# EAGLE schematic ewheel32 (EAGLE 7.7.0)
AUTHOR: (C) Peter Schmid <peter@spyr.ch>; COPYRIGHT: This work is licensed under a Creative Commons Attribution-ShareAlike 4.0 International Public License. http://creativecommons.org/licenses/by-sa/4.0/; LINK: http://veloblingbling.ch; PROJECT_NAME: Velo Bling-Bling; VERSION: Version: 2.3

## Sheet 1 of 2
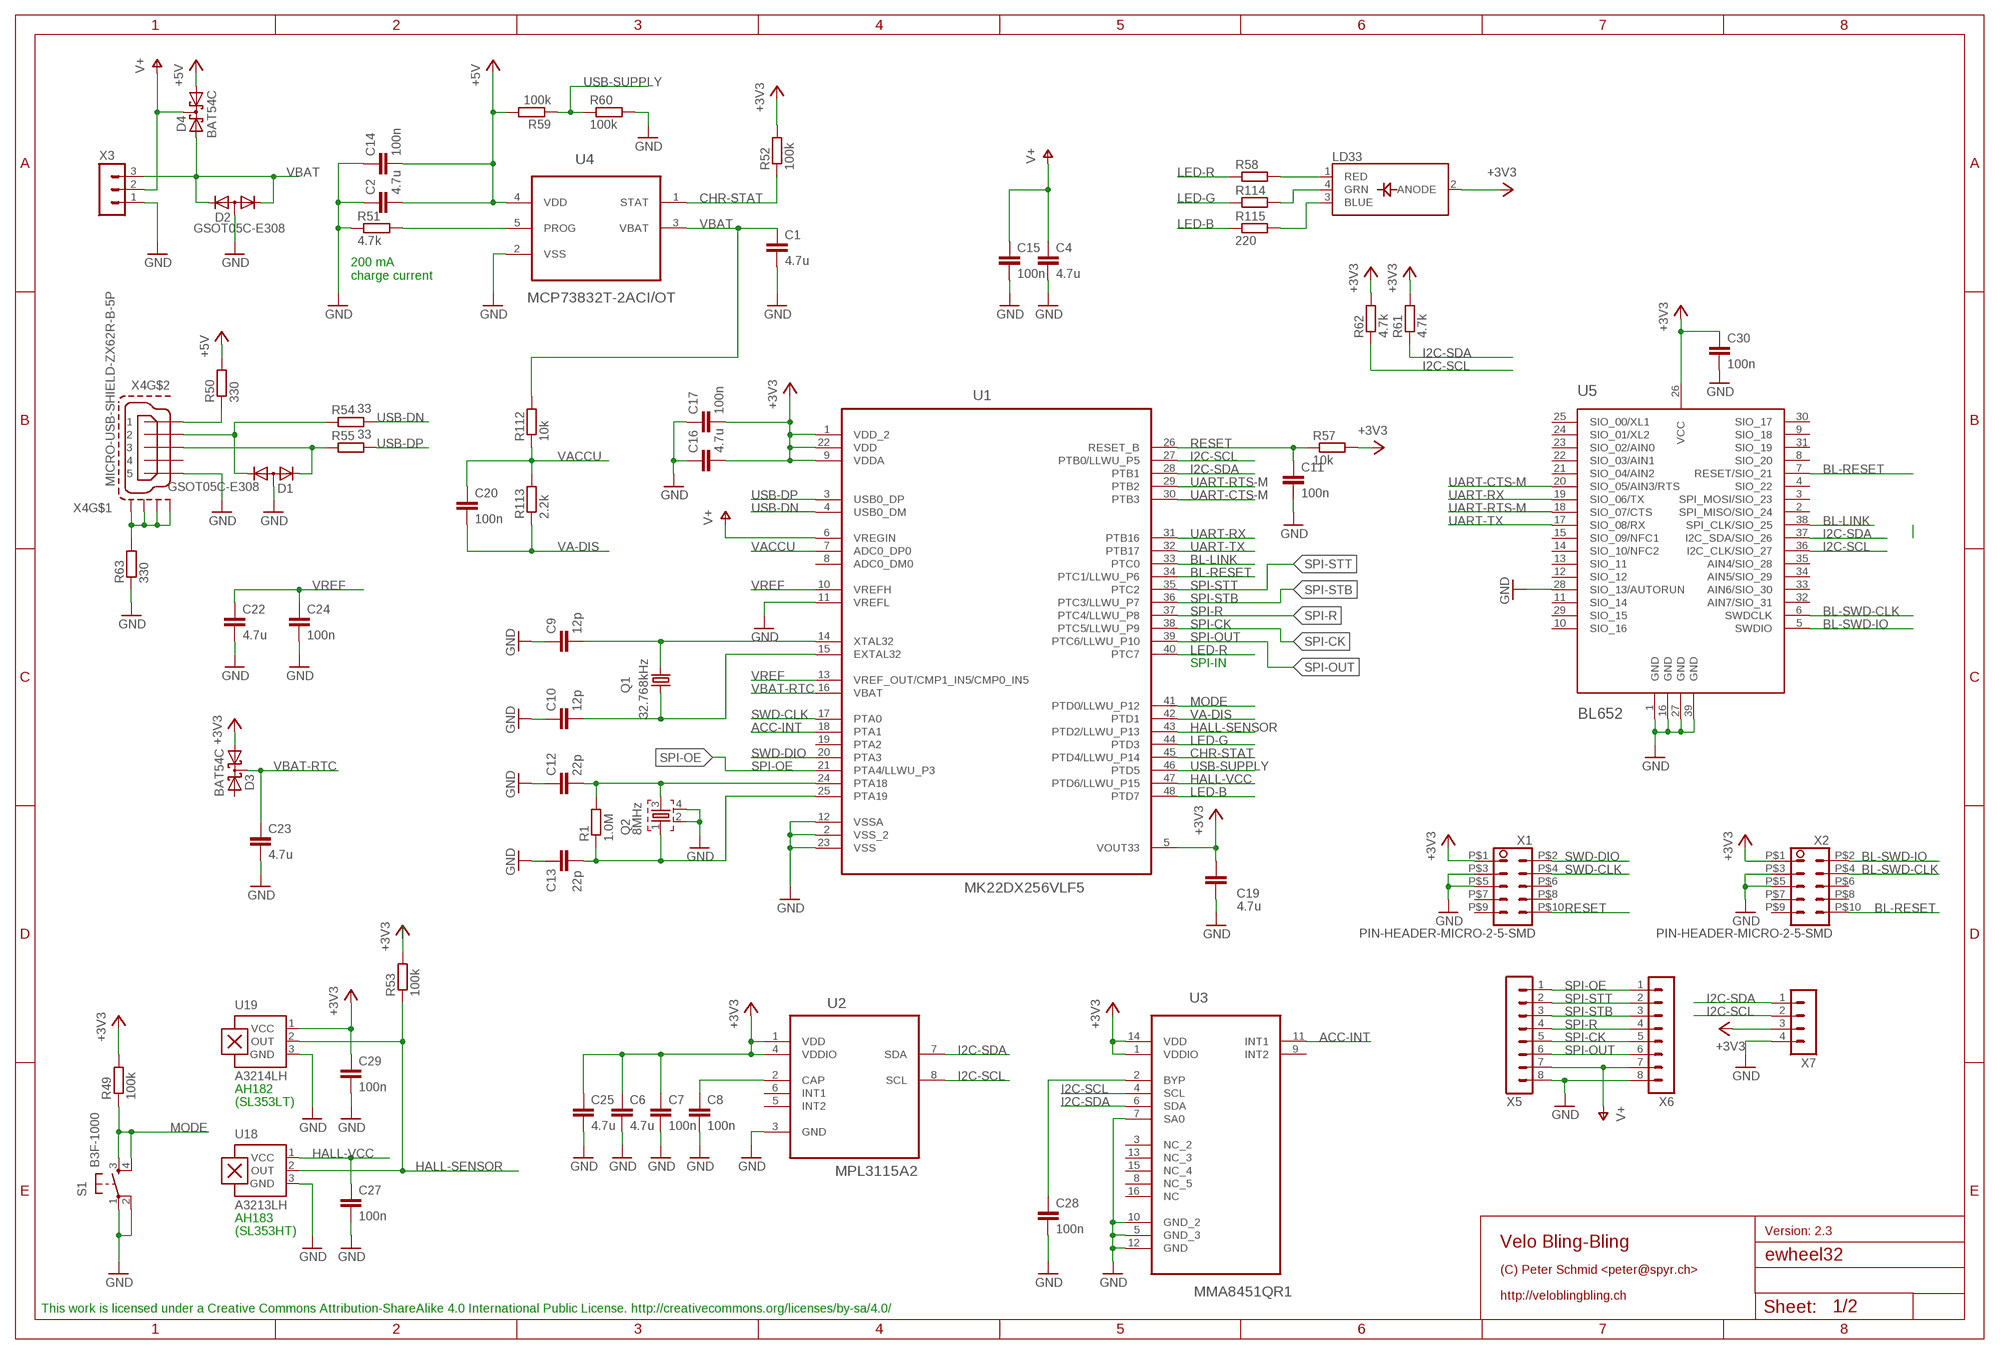
[diagram p0: schematic, sheet 1]

### Parts
C1  4.7u  C-EUC0805  [C0805]
C2  4.7u  C-EUC0805  [C0805]
C4  4.7u  C-EUC0805  [C0805]
C6  4.7u  C-EUC0805  [C0805]
C7  100n  C-EUC0805  [C0805]
C8  100n  C-EUC0805  [C0805]
C9  12p  C-EUC0805  [C0805]
C10  12p  C-EUC0805  [C0805]
C11  100n  C-EUC0805  [C0805]
C12  22p  C-EUC0805  [C0805]
C13  22p  C-EUC0805  [C0805]
C14  100n  C-EUC0805  [C0805]
C15  100n  C-EUC0805  [C0805]
C16  4.7u  C-EUC0805  [C0805]
C17  100n  C-EUC0805  [C0805]
C19  4.7u  C-EUC0805  [C0805]
C20  100n  C-EUC0805  [C0805]
C22  4.7u  C-EUC0805  [C0805]
C23  4.7u  C-EUC0805  [C0805]
C24  100n  C-EUC0805  [C0805]
C25  4.7u  C-EUC0805  [C0805]
C27  100n  C-EUC0805  [C0805]
C28  100n  C-EUC0805  [C0805]
C29  100n  C-EUC0805  [C0805]
C30  100n  C-EUC0805  [C0805]
D1  GSOT05C-E308  DIODE-2CA|ACSOT23  [SOT23]
D2  GSOT05C-E308  DIODE-2CA|ACSOT23  [SOT23]
D3  BAT54C  [SOT23]
D4  BAT54C  [SOT23]
LD33  CLV1A-FKB  LED-RGB  [RGBLED-PLCC4]
Q1  32.768kHz  ABS07  [ABS07]
Q2  8MHz  ABM3B  [ABM3B]
R1  1.0M  R-EU_R0805  [R0805]
R49  100k  R-EU_R0805  [R0805]
R50  330  R-EU_R1206  [R1206]
R51  4.7k  R-EU_R0805  [R0805]
R52  100k  R-EU_R0805  [R0805]
R53  100k  R-EU_R0805  [R0805]
R54  33  R-EU_R0805  [R0805]
R55  33  R-EU_R0805  [R0805]
R57  10k  R-EU_R0805  [R0805]
R58  220  R-EU_R0805  [R0805]
R59  100k  R-EU_R0805  [R0805]
R60  100k  R-EU_R0805  [R0805]
R61  4.7k  R-EU_R0805  [R0805]
R62  4.7k  R-EU_R0805  [R0805]
R63  330  R-EU_R1206  [R1206]
R112  10k  R-EU_R0805  [R0805]
R113  2.2k  R-EU_R0805  [R0805]
R114  220  R-EU_R0805  [R0805]
R115  220  R-EU_R0805  [R0805]
S1  B3F-1000  B3S-1000  [B3S-1000]
U1  MK22DX256VLF5  MK20DX128VLF5  [QFP50P900X900X160-48N]
U2  MPL3115A2  [DFN300X500X120-8N]
U3  MMA8451QR1  [QFN50P300X300X100-16N]
U4  MCP73832T-2ACI/OT  MCP73831T-2ACI/OT  [SOT95P280X145-5N]
U5  BL652  LAIRD_BL652  [BL652]
U18  A3213LH  A1381LH  [SOT23-W]
U19  A3214LH  A1381LH  [SOT23-W]
X1  PIN-HEADER-MICRO-2-5-SMD  [PIN-HEADER-NICRO-2-5-SMD]
X2  PIN-HEADER-MICRO-2-5-SMD  [PIN-HEADER-NICRO-2-5-SMD]
X3  MA03-1  [MA03-1]
X4  MICRO-USB-SHIELD-ZX62R-B-5P  [ZX62R-B-5P]
X5  MA08-1  [MA08-1]
X6  MA08-1  [MA08-1]
X7  MA04-1  [MA04-1]

### Nets
+3V3 [power]: C6.1 C7.1 C16.2 C17.2 C19.1 C25.1 C29.1 C30.1 D3.1(A1) LD33.2(ANODE) R49.2 R52.2 R53.2 R57.2 R61.2 R62.2 U1.1(VDD_2) U1.5(VOUT33) U1.9(VDDA) U1.22(VDD) U2.1(VDD) U2.4(VDDIO) U3.1(VDDIO) U3.14(VDD) U5.26(VCC) U19.1(VCC) X1.P$1 X2.P$1 X7.3
+5V: C2.2 C14.2 D4.1(A1) R50.2 R59.2 U4.4(VDD)
ACC-INT: U1.18(PTA1) U3.11(INT1)
BL-LINK: U1.33(PTC0) U5.38(SPI_CLK/SIO_25)
BL-RESET: U1.34(PTC1/LLWU_P6) U5.7(RESET/SIO_21) X2.P$10
BL-SWD-CLK: U5.6(SWDCLK) X2.P$4
BL-SWD-IO: U5.5(SWDIO) X2.P$2
CHR-STAT: R52.1 U1.45(PTD4/LLWU_P14) U4.1(STAT)
GND [gnd]: C1.2 C2.1 C4.2 C6.2 C7.2 C8.2 C9.1 C10.1 C11.2 C12.1 C13.1 C14.1 C15.2 C16.1 C17.1 C19.2 C22.2 C23.2 C24.2 C25.2 C27.2 C28.2 C29.2 C30.2 D1.3(A) D2.3(A) Q2.2 Q2.4 R51.1 R60.2 R63.1 S1.1(P) S1.2(P1) U1.2(VSS_2) U1.11(VREFL) U1.12(VSSA) U1.23(VSS) U2.3(GND) U3.5(GND_3) U3.7(SA0) U3.10(GND_2) U3.12(GND) U4.2(VSS) U5.1(GND) U5.16(GND) U5.27(GND) U5.28(SIO_13/AUTORUN) U5.39(GND) U18.3(GND) U19.3(GND) X1.P$3 X1.P$5 X2.P$3 X2.P$5 X3.1 X4.5 X5.8 X6.8 X7.4 ; also sheet 2
HALL-SENSOR: R53.1 U1.43(PTD2/LLWU_P13) U18.2(OUT) U19.2(OUT)
HALL-VCC: C27.1 U1.47(PTD6/LLWU_P15) U18.1(VCC)
I2C-SCL: R62.1 U1.27(PTB0/LLWU_P5) U2.8(SCL) U3.4(SCL) U5.36(I2C_CLK/SIO_27) X7.2
I2C-SDA: R61.1 U1.28(PTB1) U2.7(SDA) U3.6(SDA) U5.37(I2C_SDA/SIO_26) X7.1
LED-B: R115.1 U1.48(PTD7)
LED-G: R114.1 U1.44(PTD3)
LED-R: R58.1 U1.40(PTC7)
MODE: R49.1 S1.3(S) S1.4(S1) U1.41(PTD0/LLWU_P12)
N$1: C12.2 Q2.3 R1.2 U1.24(PTA18)
N$2: C13.2 Q2.1 R1.1 U1.25(PTA19)
N$4: C28.1 U3.2(BYP)
N$5: R51.2 U4.5(PROG)
N$6: LD33.4(GRN) R114.2
N$7: LD33.1(RED) R58.2
N$8: LD33.3(BLUE) R115.2
N$55: R63.2 X4.M1(S1) X4.M2(S2) X4.M3(S3) X4.M4(S4)
N$59: C8.1 U2.2(CAP)
N$60: R50.1 X4.1
N$61: D1.1(K1) R54.1 X4.2
N$62: D1.2(K2) R55.1 X4.3
N$63: C9.2 Q1.P$2 U1.14(XTAL32)
N$64: C10.2 Q1.P$1 U1.15(EXTAL32)
RESET: C11.1 R57.1 U1.26(RESET_B) X1.P$10
SPI-CK: U1.38(PTC5/LLWU_P9) X5.5 X6.5 ; also sheet 2
SPI-OE: U1.21(PTA4/LLWU_P3) X5.1 X6.1 ; also sheet 2
SPI-OUT: U1.39(PTC6/LLWU_P10) X5.6 X6.6 ; also sheet 2
SPI-R: U1.37(PTC4/LLWU_P8) X5.4 X6.4 ; also sheet 2
SPI-STB: U1.36(PTC3/LLWU_P7) X5.3 X6.3 ; also sheet 2
SPI-STT: U1.35(PTC2) X5.2 X6.2 ; also sheet 2
SWD-CLK: U1.17(PTA0) X1.P$4
SWD-DIO: U1.20(PTA3) X1.P$2
UART-CTS-M: U1.30(PTB3) U5.20(SIO_05/AIN3/RTS)
UART-RTS-M: U1.29(PTB2) U5.18(SIO_07/CTS)
UART-RX: U1.31(PTB16) U5.19(SIO_06/TX)
UART-TX: U1.32(PTB17) U5.17(SIO_08/RX)
USB-DN: R54.2 U1.4(USB0_DM)
USB-DP: R55.2 U1.3(USB0_DP)
USB-SUPPLY: R59.1 R60.1 U1.46(PTD5)
V+ [power]: C4.1 C15.1 D4.3(CC) U1.6(VREGIN) X3.2 X5.7 X6.7 ; also sheet 2
VA-DIS: C20.2 R113.1 U1.42(PTD1)
VACCU: C20.1 R112.1 R113.2 U1.7(ADC0_DP0)
VBAT: C1.1 D2.1(K1) D2.2(K2) D4.2(A2) R112.2 U4.3(VBAT) X3.3
VBAT-RTC: C23.1 D3.3(CC) U1.16(VBAT)
VREF [power]: C22.1 C24.1 U1.10(VREFH) U1.13(VREF_OUT/CMP1_IN5/CMP0_IN5)
Unconnected: D3.2(A2) U1.8(ADC0_DM0) U1.19(PTA2) U2.5(INT2) U2.6(INT1) U3.3(NC_2) U3.8(NC_5) U3.9(INT2) U3.13(NC_3) U3.15(NC_4) U3.16(NC) U5.2(SPI_MISO/SIO_24) U5.3(SPI_MOSI/SIO_23) U5.4(SIO_22) U5.8(SIO_20) U5.9(SIO_18) U5.10(SIO_16) U5.11(SIO_14) U5.12(SIO_12) U5.13(SIO_11) U5.14(SIO_10/NFC2) U5.15(SIO_09/NFC1) U5.21(SIO_04/AIN2) U5.22(SIO_03/AIN1) U5.23(SIO_02/AIN0) U5.24(SIO_01/XL2) U5.25(SIO_00/XL1) U5.29(SIO_15) U5.30(SIO_17) U5.31(SIO_19) U5.32(AIN7/SIO_31) U5.33(AIN6/SIO_30) U5.34(AIN5/SIO_29) U5.35(AIN4/SIO_28) X1.P$6 X1.P$7 X1.P$8 X1.P$9 X2.P$6 X2.P$7 X2.P$8 X2.P$9 X4.4

### Notes on the sheet
- 200 mA 
  charge current
- SPI-IN
- AH182
- (SL353LT)
- AH183
- (SL353HT)

## Sheet 2 of 2
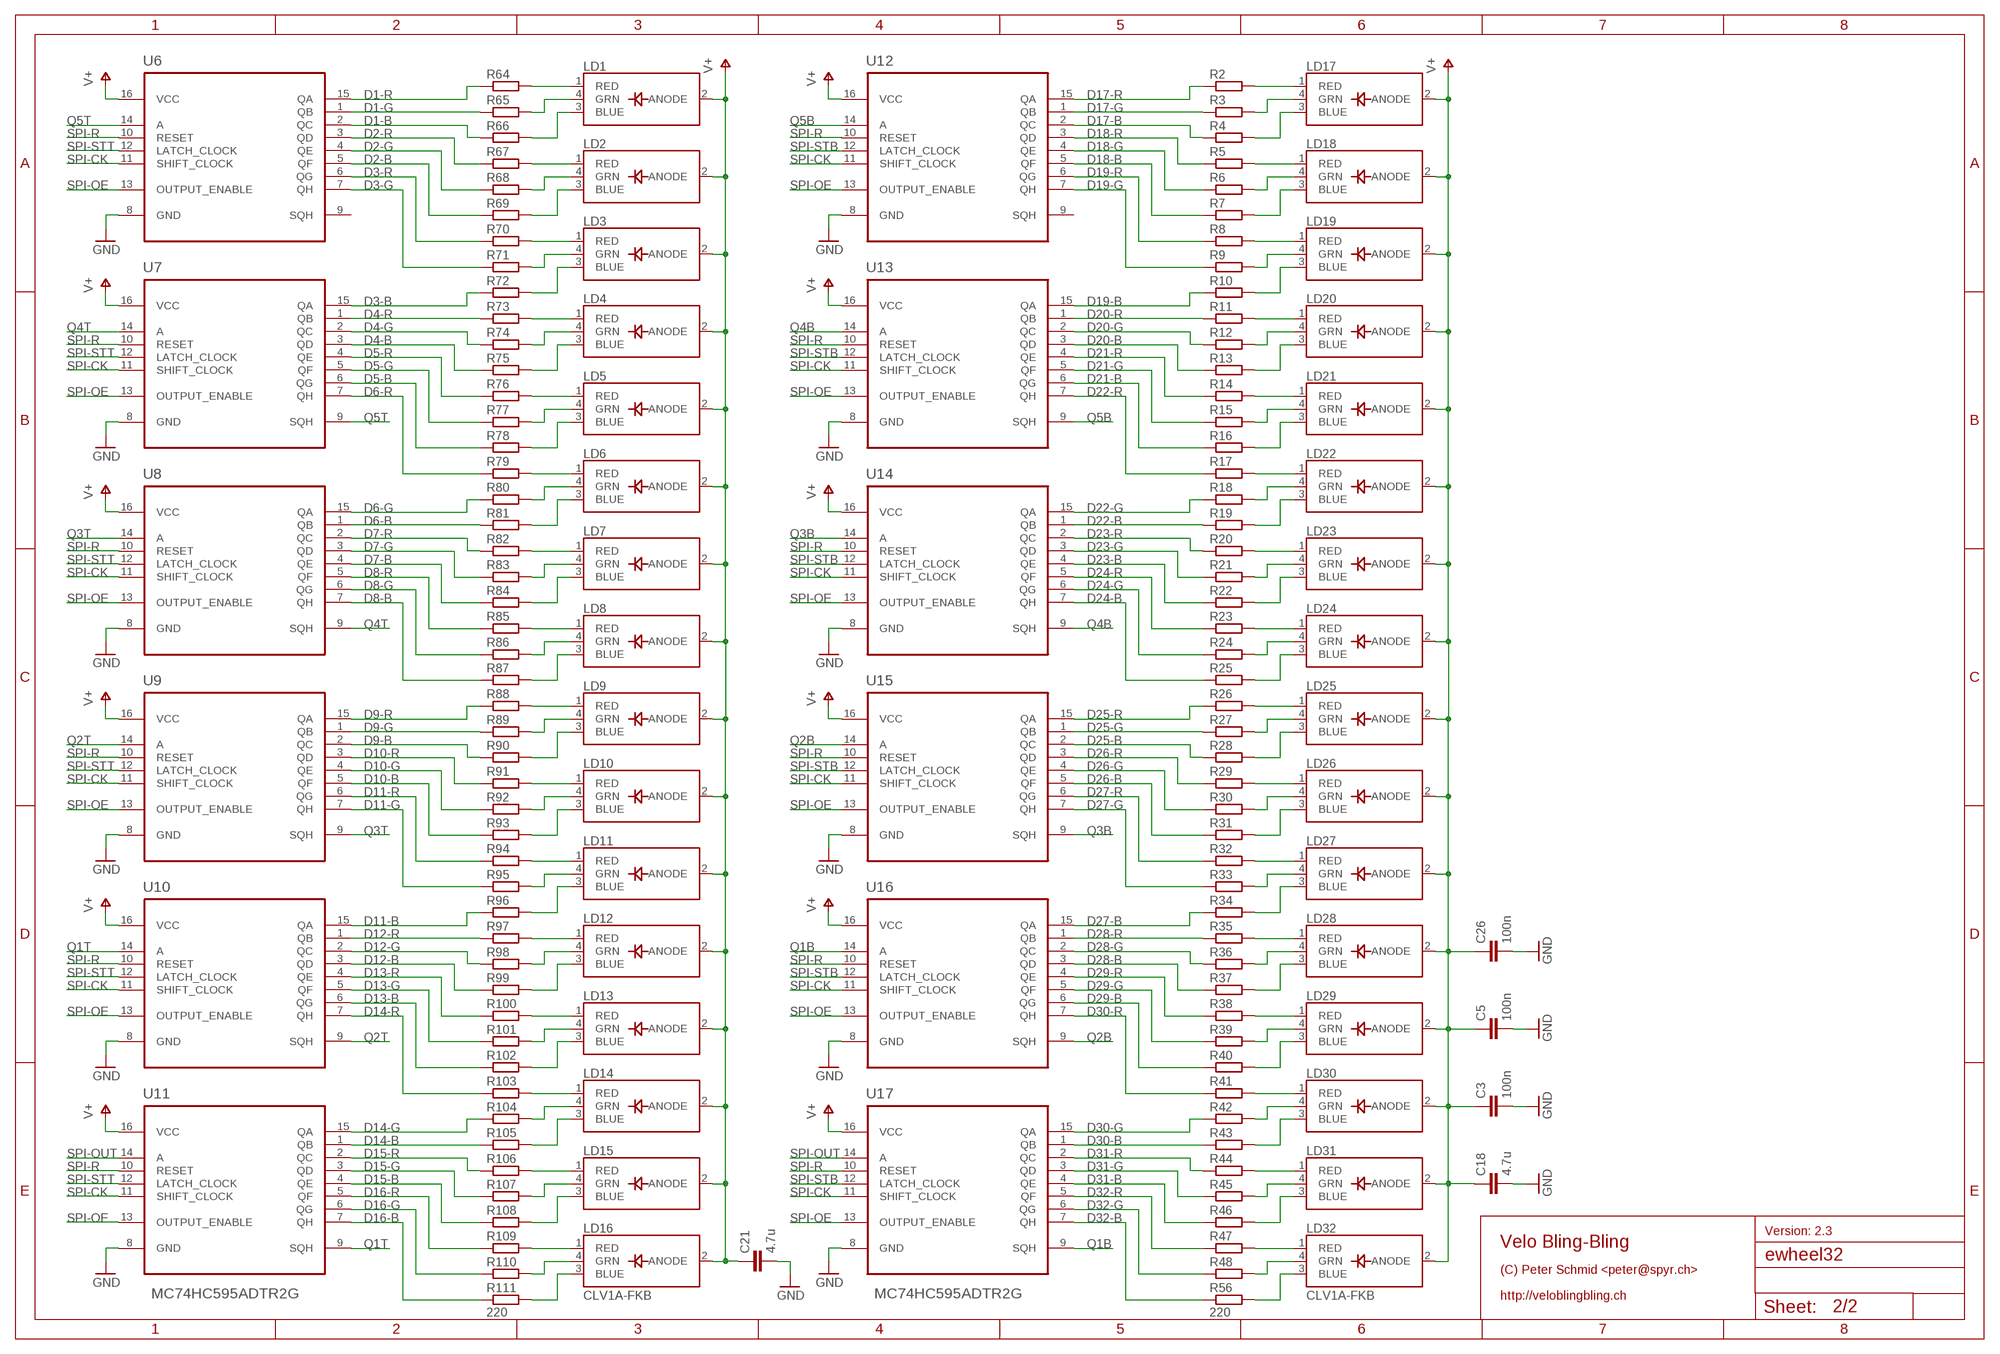
[diagram p1: schematic, sheet 2]

### Parts
C3  100n  C-EUC0805  [C0805]
C5  100n  C-EUC0805  [C0805]
C18  4.7u  C-EUC0805  [C0805]
C21  4.7u  C-EUC0805  [C0805]
C26  100n  C-EUC0805  [C0805]
LD1  CLV1A-FKB  LED-RGB  [RGBLED-PLCC4]
LD2  CLV1A-FKB  LED-RGB  [RGBLED-PLCC4]
LD3  CLV1A-FKB  LED-RGB  [RGBLED-PLCC4]
LD4  CLV1A-FKB  LED-RGB  [RGBLED-PLCC4]
LD5  CLV1A-FKB  LED-RGB  [RGBLED-PLCC4]
LD6  CLV1A-FKB  LED-RGB  [RGBLED-PLCC4]
LD7  CLV1A-FKB  LED-RGB  [RGBLED-PLCC4]
LD8  CLV1A-FKB  LED-RGB  [RGBLED-PLCC4]
LD9  CLV1A-FKB  LED-RGB  [RGBLED-PLCC4]
LD10  CLV1A-FKB  LED-RGB  [RGBLED-PLCC4]
LD11  CLV1A-FKB  LED-RGB  [RGBLED-PLCC4]
LD12  CLV1A-FKB  LED-RGB  [RGBLED-PLCC4]
LD13  CLV1A-FKB  LED-RGB  [RGBLED-PLCC4]
LD14  CLV1A-FKB  LED-RGB  [RGBLED-PLCC4]
LD15  CLV1A-FKB  LED-RGB  [RGBLED-PLCC4]
LD16  CLV1A-FKB  LED-RGB  [RGBLED-PLCC4]
LD17  CLV1A-FKB  LED-RGB  [RGBLED-PLCC4]
LD18  CLV1A-FKB  LED-RGB  [RGBLED-PLCC4]
LD19  CLV1A-FKB  LED-RGB  [RGBLED-PLCC4]
LD20  CLV1A-FKB  LED-RGB  [RGBLED-PLCC4]
LD21  CLV1A-FKB  LED-RGB  [RGBLED-PLCC4]
LD22  CLV1A-FKB  LED-RGB  [RGBLED-PLCC4]
LD23  CLV1A-FKB  LED-RGB  [RGBLED-PLCC4]
LD24  CLV1A-FKB  LED-RGB  [RGBLED-PLCC4]
LD25  CLV1A-FKB  LED-RGB  [RGBLED-PLCC4]
LD26  CLV1A-FKB  LED-RGB  [RGBLED-PLCC4]
LD27  CLV1A-FKB  LED-RGB  [RGBLED-PLCC4]
LD28  CLV1A-FKB  LED-RGB  [RGBLED-PLCC4]
LD29  CLV1A-FKB  LED-RGB  [RGBLED-PLCC4]
LD30  CLV1A-FKB  LED-RGB  [RGBLED-PLCC4]
LD31  CLV1A-FKB  LED-RGB  [RGBLED-PLCC4]
LD32  CLV1A-FKB  LED-RGB  [RGBLED-PLCC4]
R2  220  R-EU_R0805  [R0805]
R3  220  R-EU_R0805  [R0805]
R4  220  R-EU_R0805  [R0805]
R5  220  R-EU_R0805  [R0805]
R6  220  R-EU_R0805  [R0805]
R7  220  R-EU_R0805  [R0805]
R8  220  R-EU_R0805  [R0805]
R9  220  R-EU_R0805  [R0805]
R10  220  R-EU_R0805  [R0805]
R11  220  R-EU_R0805  [R0805]
R12  220  R-EU_R0805  [R0805]
R13  220  R-EU_R0805  [R0805]
R14  220  R-EU_R0805  [R0805]
R15  220  R-EU_R0805  [R0805]
R16  220  R-EU_R0805  [R0805]
R17  220  R-EU_R0805  [R0805]
R18  220  R-EU_R0805  [R0805]
R19  220  R-EU_R0805  [R0805]
R20  220  R-EU_R0805  [R0805]
R21  220  R-EU_R0805  [R0805]
R22  220  R-EU_R0805  [R0805]
R23  220  R-EU_R0805  [R0805]
R24  220  R-EU_R0805  [R0805]
R25  220  R-EU_R0805  [R0805]
R26  220  R-EU_R0805  [R0805]
R27  220  R-EU_R0805  [R0805]
R28  220  R-EU_R0805  [R0805]
R29  220  R-EU_R0805  [R0805]
R30  220  R-EU_R0805  [R0805]
R31  220  R-EU_R0805  [R0805]
R32  220  R-EU_R0805  [R0805]
R33  220  R-EU_R0805  [R0805]
R34  220  R-EU_R0805  [R0805]
R35  220  R-EU_R0805  [R0805]
R36  220  R-EU_R0805  [R0805]
R37  220  R-EU_R0805  [R0805]
R38  220  R-EU_R0805  [R0805]
R39  220  R-EU_R0805  [R0805]
R40  220  R-EU_R0805  [R0805]
R41  220  R-EU_R0805  [R0805]
R42  220  R-EU_R0805  [R0805]
R43  220  R-EU_R0805  [R0805]
R44  220  R-EU_R0805  [R0805]
R45  220  R-EU_R0805  [R0805]
R46  220  R-EU_R0805  [R0805]
R47  220  R-EU_R0805  [R0805]
R48  220  R-EU_R0805  [R0805]
R56  220  R-EU_R0805  [R0805]
R64  220  R-EU_R0805  [R0805]
R65  220  R-EU_R0805  [R0805]
R66  220  R-EU_R0805  [R0805]
R67  220  R-EU_R0805  [R0805]
R68  220  R-EU_R0805  [R0805]
R69  220  R-EU_R0805  [R0805]
R70  220  R-EU_R0805  [R0805]
R71  220  R-EU_R0805  [R0805]
R72  220  R-EU_R0805  [R0805]
R73  220  R-EU_R0805  [R0805]
R74  220  R-EU_R0805  [R0805]
R75  220  R-EU_R0805  [R0805]
R76  220  R-EU_R0805  [R0805]
R77  220  R-EU_R0805  [R0805]
R78  220  R-EU_R0805  [R0805]
R79  220  R-EU_R0805  [R0805]
R80  220  R-EU_R0805  [R0805]
R81  220  R-EU_R0805  [R0805]
R82  220  R-EU_R0805  [R0805]
R83  220  R-EU_R0805  [R0805]
R84  220  R-EU_R0805  [R0805]
R85  220  R-EU_R0805  [R0805]
R86  220  R-EU_R0805  [R0805]
R87  220  R-EU_R0805  [R0805]
R88  220  R-EU_R0805  [R0805]
R89  220  R-EU_R0805  [R0805]
R90  220  R-EU_R0805  [R0805]
R91  220  R-EU_R0805  [R0805]
R92  220  R-EU_R0805  [R0805]
R93  220  R-EU_R0805  [R0805]
R94  220  R-EU_R0805  [R0805]
R95  220  R-EU_R0805  [R0805]
R96  220  R-EU_R0805  [R0805]
R97  220  R-EU_R0805  [R0805]
R98  220  R-EU_R0805  [R0805]
R99  220  R-EU_R0805  [R0805]
R100  220  R-EU_R0805  [R0805]
R101  220  R-EU_R0805  [R0805]
R102  220  R-EU_R0805  [R0805]
R103  220  R-EU_R0805  [R0805]
R104  220  R-EU_R0805  [R0805]
R105  220  R-EU_R0805  [R0805]
R106  220  R-EU_R0805  [R0805]
R107  220  R-EU_R0805  [R0805]
R108  220  R-EU_R0805  [R0805]
R109  220  R-EU_R0805  [R0805]
R110  220  R-EU_R0805  [R0805]
R111  220  R-EU_R0805  [R0805]
U6  MC74HC595ADTR2G  [SOP65P640X120-16N]
U7  MC74HC595ADTR2G  [SOP65P640X120-16N]
U8  MC74HC595ADTR2G  [SOP65P640X120-16N]
U9  MC74HC595ADTR2G  [SOP65P640X120-16N]
U10  MC74HC595ADTR2G  [SOP65P640X120-16N]
U11  MC74HC595ADTR2G  [SOP65P640X120-16N]
U12  MC74HC595ADTR2G  [SOP65P640X120-16N]
U13  MC74HC595ADTR2G  [SOP65P640X120-16N]
U14  MC74HC595ADTR2G  [SOP65P640X120-16N]
U15  MC74HC595ADTR2G  [SOP65P640X120-16N]
U16  MC74HC595ADTR2G  [SOP65P640X120-16N]
U17  MC74HC595ADTR2G  [SOP65P640X120-16N]

### Nets
D1-B: R66.1 U6.2(QC)
D1-G: R65.1 U6.1(QB)
D1-R: R64.1 U6.15(QA)
D2-B: R69.1 U6.5(QF)
D2-G: R68.1 U6.4(QE)
D2-R: R67.1 U6.3(QD)
D3-B: R72.1 U7.15(QA)
D3-G: R71.1 U6.7(QH)
D3-R: R70.1 U6.6(QG)
D4-B: R75.1 U7.3(QD)
D4-G: R74.1 U7.2(QC)
D4-R: R73.1 U7.1(QB)
D5-B: R78.1 U7.6(QG)
D5-G: R77.1 U7.5(QF)
D5-R: R76.1 U7.4(QE)
D6-B: R81.1 U8.1(QB)
D6-G: R80.1 U8.15(QA)
D6-R: R79.1 U7.7(QH)
D7-B: R84.1 U8.4(QE)
D7-G: R83.1 U8.3(QD)
D7-R: R82.1 U8.2(QC)
D8-B: R87.1 U8.7(QH)
D8-G: R86.1 U8.6(QG)
D8-R: R85.1 U8.5(QF)
D9-B: R90.1 U9.2(QC)
D9-G: R89.1 U9.1(QB)
D9-R: R88.1 U9.15(QA)
D10-B: R93.1 U9.5(QF)
D10-G: R92.1 U9.4(QE)
D10-R: R91.1 U9.3(QD)
D11-B: R96.1 U10.15(QA)
D11-G: R95.1 U9.7(QH)
D11-R: R94.1 U9.6(QG)
D12-B: R99.1 U10.3(QD)
D12-G: R98.1 U10.2(QC)
D12-R: R97.1 U10.1(QB)
D13-B: R102.1 U10.6(QG)
D13-G: R101.1 U10.5(QF)
D13-R: R100.1 U10.4(QE)
D14-B: R105.1 U11.1(QB)
D14-G: R104.1 U11.15(QA)
D14-R: R103.1 U10.7(QH)
D15-B: R108.1 U11.4(QE)
D15-G: R107.1 U11.3(QD)
D15-R: R106.1 U11.2(QC)
D16-B: R111.1 U11.7(QH)
D16-G: R110.1 U11.6(QG)
D16-R: R109.1 U11.5(QF)
D17-B: R4.1 U12.2(QC)
D17-G: R3.1 U12.1(QB)
D17-R: R2.1 U12.15(QA)
D18-B: R7.1 U12.5(QF)
D18-G: R6.1 U12.4(QE)
D18-R: R5.1 U12.3(QD)
D19-B: R10.1 U13.15(QA)
D19-G: R9.1 U12.7(QH)
D19-R: R8.1 U12.6(QG)
D20-B: R13.1 U13.3(QD)
D20-G: R12.1 U13.2(QC)
D20-R: R11.1 U13.1(QB)
D21-B: R16.1 U13.6(QG)
D21-G: R15.1 U13.5(QF)
D21-R: R14.1 U13.4(QE)
D22-B: R19.1 U14.1(QB)
D22-G: R18.1 U14.15(QA)
D22-R: R17.1 U13.7(QH)
D23-B: R22.1 U14.4(QE)
D23-G: R21.1 U14.3(QD)
D23-R: R20.1 U14.2(QC)
D24-B: R25.1 U14.7(QH)
D24-G: R24.1 U14.6(QG)
D24-R: R23.1 U14.5(QF)
D25-B: R28.1 U15.2(QC)
D25-G: R27.1 U15.1(QB)
D25-R: R26.1 U15.15(QA)
D26-B: R31.1 U15.5(QF)
D26-G: R30.1 U15.4(QE)
D26-R: R29.1 U15.3(QD)
D27-B: R34.1 U16.15(QA)
D27-G: R33.1 U15.7(QH)
D27-R: R32.1 U15.6(QG)
D28-B: R37.1 U16.3(QD)
D28-G: R36.1 U16.2(QC)
D28-R: R35.1 U16.1(QB)
D29-B: R40.1 U16.6(QG)
D29-G: R39.1 U16.5(QF)
D29-R: R38.1 U16.4(QE)
D30-B: R43.1 U17.1(QB)
D30-G: R42.1 U17.15(QA)
D30-R: R41.1 U16.7(QH)
D31-B: R46.1 U17.4(QE)
D31-G: R45.1 U17.3(QD)
D31-R: R44.1 U17.2(QC)
D32-B: R56.1 U17.7(QH)
D32-G: R48.1 U17.6(QG)
D32-R: R47.1 U17.5(QF)
GND [gnd]: C3.2 C5.2 C18.2 C21.2 C26.2 U6.8(GND) U7.8(GND) U8.8(GND) U9.8(GND) U10.8(GND) U11.8(GND) U12.8(GND) U13.8(GND) U14.8(GND) U15.8(GND) U16.8(GND) U17.8(GND) ; also sheet 1
N$3: LD17.4(GRN) R3.2
N$10: LD17.1(RED) R2.2
N$12: LD17.3(BLUE) R4.2
N$13: LD18.4(GRN) R6.2
N$14: LD18.1(RED) R5.2
N$16: LD18.3(BLUE) R7.2
N$17: LD19.4(GRN) R9.2
N$18: LD19.1(RED) R8.2
N$20: LD19.3(BLUE) R10.2
N$21: LD20.4(GRN) R12.2
N$22: LD20.1(RED) R11.2
N$25: LD20.3(BLUE) R13.2
N$26: LD21.4(GRN) R15.2
N$27: LD21.1(RED) R14.2
N$28: LD21.3(BLUE) R16.2
N$29: LD22.4(GRN) R18.2
N$30: LD22.1(RED) R17.2
N$31: LD22.3(BLUE) R19.2
N$32: LD23.4(GRN) R21.2
N$33: LD23.1(RED) R20.2
N$34: LD23.3(BLUE) R22.2
N$35: LD24.4(GRN) R24.2
N$36: LD24.1(RED) R23.2
N$37: LD24.3(BLUE) R25.2
N$38: LD25.4(GRN) R27.2
N$39: LD25.1(RED) R26.2
N$40: LD25.3(BLUE) R28.2
N$41: LD26.4(GRN) R30.2
N$42: LD26.1(RED) R29.2
N$43: LD26.3(BLUE) R31.2
N$44: LD27.4(GRN) R33.2
N$45: LD27.1(RED) R32.2
N$46: LD27.3(BLUE) R34.2
N$47: LD28.4(GRN) R36.2
N$48: LD28.1(RED) R35.2
N$67: LD1.4(GRN) R65.2
N$68: LD1.1(RED) R64.2
N$69: LD1.3(BLUE) R66.2
N$70: LD2.4(GRN) R68.2
N$71: LD2.1(RED) R67.2
N$72: LD2.3(BLUE) R69.2
N$73: LD3.4(GRN) R71.2
N$74: LD3.1(RED) R70.2
N$75: LD3.3(BLUE) R72.2
N$76: LD4.4(GRN) R74.2
N$77: LD4.1(RED) R73.2
N$78: LD4.3(BLUE) R75.2
N$79: LD5.4(GRN) R77.2
N$80: LD5.1(RED) R76.2
N$81: LD5.3(BLUE) R78.2
N$82: LD6.4(GRN) R80.2
N$83: LD6.1(RED) R79.2
N$84: LD6.3(BLUE) R81.2
N$85: LD7.4(GRN) R83.2
N$86: LD7.1(RED) R82.2
N$87: LD7.3(BLUE) R84.2
N$88: LD8.4(GRN) R86.2
N$89: LD8.1(RED) R85.2
N$90: LD8.3(BLUE) R87.2
N$91: LD9.4(GRN) R89.2
N$92: LD9.1(RED) R88.2
N$93: LD9.3(BLUE) R90.2
N$94: LD10.4(GRN) R92.2
N$95: LD10.1(RED) R91.2
N$96: LD10.3(BLUE) R93.2
N$97: LD11.4(GRN) R95.2
N$98: LD11.1(RED) R94.2
N$99: LD11.3(BLUE) R96.2
N$100: LD12.4(GRN) R98.2
N$101: LD12.1(RED) R97.2
N$102: LD12.3(BLUE) R99.2
N$103: LD13.4(GRN) R101.2
N$104: LD13.1(RED) R100.2
N$105: LD13.3(BLUE) R102.2
N$106: LD14.4(GRN) R104.2
N$107: LD14.1(RED) R103.2
N$108: LD14.3(BLUE) R105.2
N$109: LD15.4(GRN) R107.2
N$110: LD15.1(RED) R106.2
N$111: LD15.3(BLUE) R108.2
N$112: LD16.4(GRN) R110.2
N$113: LD16.1(RED) R109.2
N$114: LD16.3(BLUE) R111.2
N$115: LD28.3(BLUE) R37.2
N$116: LD29.4(GRN) R39.2
N$117: LD29.1(RED) R38.2
N$118: LD29.3(BLUE) R40.2
N$119: LD30.4(GRN) R42.2
N$120: LD30.1(RED) R41.2
N$121: LD30.3(BLUE) R43.2
N$122: LD31.4(GRN) R45.2
N$123: LD31.1(RED) R44.2
N$124: LD31.3(BLUE) R46.2
N$125: LD32.4(GRN) R48.2
N$126: LD32.1(RED) R47.2
N$127: LD32.3(BLUE) R56.2
Q1B: U16.14(A) U17.9(SQH)
Q1T: U10.14(A) U11.9(SQH)
Q2B: U15.14(A) U16.9(SQH)
Q2T: U9.14(A) U10.9(SQH)
Q3B: U14.14(A) U15.9(SQH)
Q3T: U8.14(A) U9.9(SQH)
Q4B: U13.14(A) U14.9(SQH)
Q4T: U7.14(A) U8.9(SQH)
Q5B: U12.14(A) U13.9(SQH)
Q5T: U6.14(A) U7.9(SQH)
SPI-CK: U6.11(SHIFT_CLOCK) U7.11(SHIFT_CLOCK) U8.11(SHIFT_CLOCK) U9.11(SHIFT_CLOCK) U10.11(SHIFT_CLOCK) U11.11(SHIFT_CLOCK) U12.11(SHIFT_CLOCK) U13.11(SHIFT_CLOCK) U14.11(SHIFT_CLOCK) U15.11(SHIFT_CLOCK) U16.11(SHIFT_CLOCK) U17.11(SHIFT_CLOCK) ; also sheet 1
SPI-OE: U6.13(OUTPUT_ENABLE) U7.13(OUTPUT_ENABLE) U8.13(OUTPUT_ENABLE) U9.13(OUTPUT_ENABLE) U10.13(OUTPUT_ENABLE) U11.13(OUTPUT_ENABLE) U12.13(OUTPUT_ENABLE) U13.13(OUTPUT_ENABLE) U14.13(OUTPUT_ENABLE) U15.13(OUTPUT_ENABLE) U16.13(OUTPUT_ENABLE) U17.13(OUTPUT_ENABLE) ; also sheet 1
SPI-OUT: U11.14(A) U17.14(A) ; also sheet 1
SPI-R: U6.10(RESET) U7.10(RESET) U8.10(RESET) U9.10(RESET) U10.10(RESET) U11.10(RESET) U12.10(RESET) U13.10(RESET) U14.10(RESET) U15.10(RESET) U16.10(RESET) U17.10(RESET) ; also sheet 1
SPI-STB: U12.12(LATCH_CLOCK) U13.12(LATCH_CLOCK) U14.12(LATCH_CLOCK) U15.12(LATCH_CLOCK) U16.12(LATCH_CLOCK) U17.12(LATCH_CLOCK) ; also sheet 1
SPI-STT: U6.12(LATCH_CLOCK) U7.12(LATCH_CLOCK) U8.12(LATCH_CLOCK) U9.12(LATCH_CLOCK) U10.12(LATCH_CLOCK) U11.12(LATCH_CLOCK) ; also sheet 1
V+ [power]: C3.1 C5.1 C18.1 C21.1 C26.1 LD1.2(ANODE) LD2.2(ANODE) LD3.2(ANODE) LD4.2(ANODE) LD5.2(ANODE) LD6.2(ANODE) LD7.2(ANODE) LD8.2(ANODE) LD9.2(ANODE) LD10.2(ANODE) LD11.2(ANODE) LD12.2(ANODE) LD13.2(ANODE) LD14.2(ANODE) LD15.2(ANODE) LD16.2(ANODE) LD17.2(ANODE) LD18.2(ANODE) LD19.2(ANODE) LD20.2(ANODE) LD21.2(ANODE) LD22.2(ANODE) LD23.2(ANODE) LD24.2(ANODE) LD25.2(ANODE) LD26.2(ANODE) LD27.2(ANODE) LD28.2(ANODE) LD29.2(ANODE) LD30.2(ANODE) LD31.2(ANODE) LD32.2(ANODE) U6.16(VCC) U7.16(VCC) U8.16(VCC) U9.16(VCC) U10.16(VCC) U11.16(VCC) U12.16(VCC) U13.16(VCC) U14.16(VCC) U15.16(VCC) U16.16(VCC) U17.16(VCC) ; also sheet 1
Unconnected: U6.9(SQH) U12.9(SQH)

## Library data of the parts
C1-C30 = resistor:C-EU: CAPACITOR, European symbol
D1 D2 = diode:DIODE-2CA|AC: Dual DIODE Cathode-Anode|Anode-Cathode
D3 D4 = diode:BAT54C: Schottky Diodes Source: Fairchild .. BAT54.pdf
LD1-LD33 = freescale-uc:LED-RGB
Q1 = freescale-uc:ABS07
Q2 = freescale-uc:ABM3B
R1-R115 = resistor:R-EU_: RESISTOR, European symbol
S1 = freescale-uc:B3S-1000
U1 = freescale-uc:MK20DX128VLF5: MCU, KINETIS, K20, CORTEX M4, 48LQFP; MPN: MK20DX128VLF5; OC_FARNELL: 2133571; OC_NEWARK: 89T6175; PACKAGE: 48LQFP; SUPPLIER: FREESCALE SEMICONDUCTOR
U2 = freescale-uc:MPL3115A2: PRESSURE SENSOR, 20-110KPA, 8LGA; MPN: MPL3115A2; OC_FARNELL: 2009084; OC_NEWARK: 48T4344; PACKAGE: 8LGA; SUPPLIER: FREESCALE SEMICONDUCTOR
U3 = Freescale_By_element14_Batch_1:MMA8451QR1: 3-Axis, 14-bit/8-bit Digital Accelerometer; MPN: MMA8451QR1; OC_FARNELL: 1908021; OC_NEWARK: 84R7350; PACKAGE: QFN-16; SUPPLIER: Freescale
U4 = freescale-uc:MCP73831T-2ACI/OT: Charge Management Controller; MPN: MCP73831T-2ACI/OT; OC_FARNELL: 1332158; OC_NEWARK: 56K7045; PACKAGE: SOT-5; SUPPLIER: Microchip
U5 = ewheel32:LAIRD_BL652: Bluetooth Low Energy Module
U6-U17 = freescale-uc:MC74HC595ADTR2G: 8-Bit Serial-Input/Serial or Parallel-Output Shift Register with Latched 3-State Outputs; MPN: MC74HC595ADTR2G; OC_FARNELL: 1607848; OC_NEWARK: 42K0910; PACKAGE: TSSOP-16; SUPPLIER: ON SEMICONDUCTOR
U18 U19 = allegro:A13*?: Linear Hall Effect Sensor ICs Continuous-Time Ratiometric High-Temperature Operation Programmable Linear with Analog Output A1302 -Replacement- UGN3503 Source: http://www.allegromicro.com/en/Products/Part_Numbers/1301/1301.pdf http://www.allegromicro.com/en/Products/Part_Numbers/1321/1321.pdf http://www.allegromicro.com/en/Products/Part_Numbers/1381/1381.pdf; MPN: A1381LLHLT-T; OC_FARNELL: unknown; OC_NEWARK: 30M9948
X1 X2 = freescale-uc:PIN-HEADER-MICRO-2-5-SMD
X3 = con-lstb:MA03-1: PIN HEADER; OC_FARNELL: unknown; OC_NEWARK: unknown
X4 = con-hirose:MICRO-USB-SHIELD-: Hirose Micro USB Connector ZX62R-B-5P: Micro B, reverse (top mount) shell SMT Supplier: DigiKey H11574CT-ND Source: http://www.hirose.co.jp/cataloge_hp/e24200011.pdf
X5 X6 = con-lstb:MA08-1: PIN HEADER; OC_FARNELL: unknown; OC_NEWARK: unknown
X7 = con-lstb:MA04-1: PIN HEADER; OC_FARNELL: unknown; OC_NEWARK: unknown

## Net classes
0 default: width 0.254 mm
1 gnd: width 0.254 mm
2 power: width 0.254 mm